# EAGLE design tbhb (EAGLE 6.4)
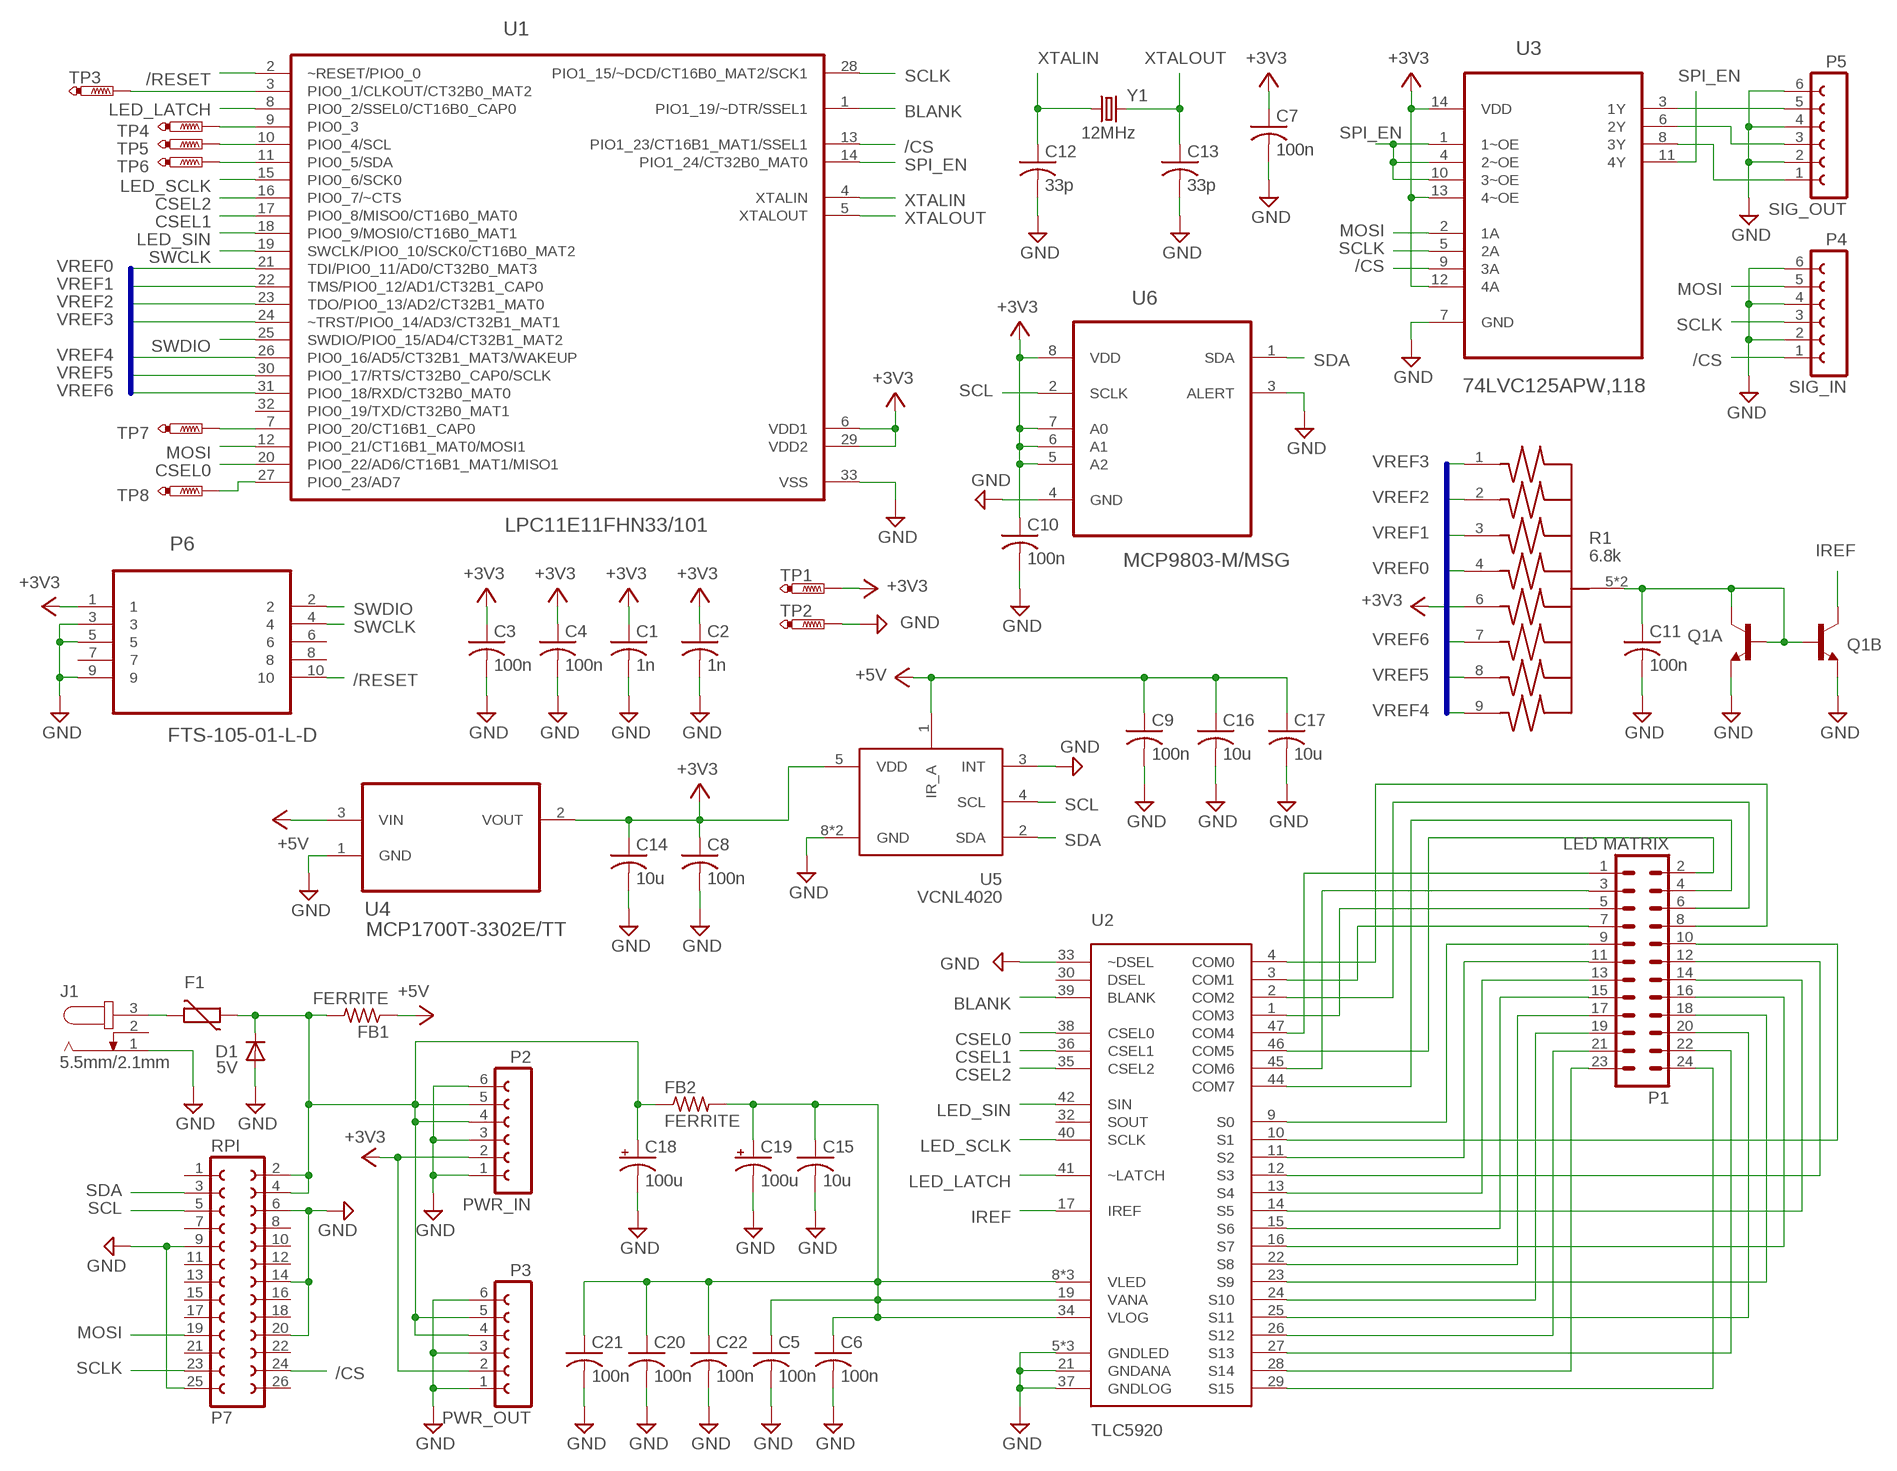
[diagram p0: schematic, sheet 1]

## Parts
C1  1n  C-USC0603  [C0603]
C2  1n  C-USC0603  [C0603]
C3  100n  C-USC0603  [C0603]
C4  100n  C-USC0603  [C0603]
C5  100n  C-USC0603  [C0603]
C6  100n  C-USC0603  [C0603]
C7  100n  C-USC0603  [C0603]
C8  100n  C-USC0603  [C0603]
C9  100n  C-USC0603  [C0603]
C10  100n  C-USC0603  [C0603]
C11  100n  C-USC0603  [C0603]
C12  33p  C-USC0603  [C0603]
C13  33p  C-USC0603  [C0603]
C14  10u  C-USC0805  [C0805]
C15  10u  C-USC0805  [C0805]
C16  10u  C-USC0805  [C0805]
C17  10u  C-USC0805  [C0805]
C18  100u  CPOL-USCT6032  [CT6032]
C19  100u  CPOL-USCT6032  [CT6032]
C20  100n  C-USC0603  [C0603]
C21  100n  C-USC0603  [C0603]
C22  100n  C-USC0603  [C0603]
D1  5V  DIODE-SOD123  [SOD123]
F1  2A  VARISTORCN1812  [CT/CN1812]
FB1  FERRITE  R-US_R0603  [R0603]
FB2  FERRITE  R-US_R0603  [R0603]
J1  5.5mm/2.1mm  JACK-PLUG  [SPC4077-1]
P1  LED MATRIX  MA12-2  [MA12-2]
P2  PWR_IN  FE06-1  [FE06]
P3  PWR_OUT  FE06-1  [FE06]
P4  SIG_IN  FE06-1  [FE06]
P5  SIG_OUT  FE06-1  [FE06]
P6  FTS-105-01-L-D  [SAMTEC_FTS-105-01-L-D]
P7  RPI  FE13-2  [FE13-2]
Q1  CMLT5088E  [SOT563]
R1  6.8k  EXBD10C  [EXBD10C]
TP1  PTR1TP15R  [TP15R]
TP2  PTR1TP15R  [TP15R]
TP3  PTR1TP15R  [TP15R]
TP4  PTR1TP15R  [TP15R]
TP5  PTR1TP15R  [TP15R]
TP6  PTR1TP15R  [TP15R]
TP7  PTR1TP15R  [TP15R]
TP8  PTR1TP15R  [TP15R]
U1  LPC11E11FHN33/101  [QFN65P700X700X100-33N]
U2  TLC5920  [SOP63P1035X279-48N]
U3  74LVC125APW,118  [SOP65P640X110-14N]
U4  MCP1700T-3302E/TT  [SOT95P237X112-3N]
U5  VCNL4020  [VCNL4020]
U6  MCP9803-M/MSG  [SOP65P490X110-8N]
Y1  12MHz  CRYSTAL-50X32  [CRYSTAL-50X32]

## Nets
+3V3: C1.1 C2.1 C3.1 C4.1 C7.1 C8.1 C10.1 C14.1 P2.2 P3.2 P6.1 R1.6 TP1.TP U1.6(VDD1) U1.29(VDD2) U3.12(4A) U3.13(4~OE) U3.14(VDD) U4.2(VOUT) U5.5(VDD) U6.5(A2) U6.6(A1) U6.7(A0) U6.8(VDD)
+5V: C9.1 C16.1 C17.1 FB1.1 U4.3(VIN) U5.1(IR_A)
/CS: P4.1 P7.24 U1.13(PIO1_23/CT16B1_MAT1/SSEL1) U3.9(3A)
/RESET: P6.10 U1.2(~RESET/PIO0_0)
BLANK: U1.1(PIO1_19/~DTR/SSEL1) U2.39(BLANK)
CSEL0: U1.20(PIO0_22/AD6/CT16B1_MAT1/MISO1) U2.38(CSEL0)
CSEL1: U1.17(PIO0_8/MISO0/CT16B0_MAT0) U2.36(CSEL1)
CSEL2: U1.16(PIO0_7/~CTS) U2.35(CSEL2)
GND: C1.2 C2.2 C3.2 C4.2 C5.2 C6.2 C7.2 C8.2 C9.2 C10.2 C11.2 C12.2 C13.2 C14.2 C15.2 C16.2 C17.2 C18.- C19.- C20.2 C21.2 C22.2 D1.A J1.1 P2.1 P2.3 P2.6 P3.1 P3.3 P3.6 P4.2 P4.4 P4.6 P5.2 P5.4 P5.6 P6.3 P6.5 P6.9 P7.6 P7.9 P7.14 P7.20 P7.25 Q1.1(A:E) Q1.4(B:E) TP2.TP U1.33(VSS) U2.5(GNDLED) U2.21(GNDANA) U2.33(~DSEL) U2.37(GNDLOG) U2.43(GNDLED) U2.48(GNDLED) U3.7(GND) U4.1(GND) U5.3(INT) U5.8(GND) U5.9(GND) U6.3(ALERT) U6.4(GND)
IREF: Q1.3(B:C) U2.17(IREF)
LED_LATCH: U1.8(PIO0_2/SSEL0/CT16B0_CAP0) U2.41(~LATCH)
LED_SCLK: U1.15(PIO0_6/SCK0) U2.40(SCLK)
LED_SIN: U1.18(PIO0_9/MOSI0/CT16B0_MAT1) U2.42(SIN)
MOSI: P4.5 P7.19 U1.12(PIO0_21/CT16B1_MAT0/MOSI1) U3.2(1A)
N$1: TP3.TP U1.3(PIO0_1/CLKOUT/CT32B0_MAT2)
N$2: C18.+ D1.C F1.1 FB1.2 FB2.1 P2.4 P2.5 P3.4 P3.5 P7.2 P7.4
N$3: P1.1 U2.47(COM4)
N$4: P1.3 U2.45(COM6)
N$5: P1.5 U2.1(COM3)
N$6: P1.7 U2.3(COM1)
N$7: P1.8 U2.4(COM0)
N$8: P1.6 U2.2(COM2)
N$9: P1.4 U2.44(COM7)
N$10: P1.2 U2.46(COM5)
N$14: P1.9 U2.9(S0)
N$15: P1.11 U2.11(S2)
N$17: TP5.TP U1.10(PIO0_4/SCL)
N$18: TP4.TP U1.9(PIO0_3)
N$19: P1.23 U2.28(S14)
N$25: P1.24 U2.29(S15)
N$26: P1.12 U2.12(S3)
N$28: P1.22 U2.27(S13)
N$29: P1.21 U2.26(S12)
N$30: P1.19 U2.24(S10)
N$31: P5.1 U3.8(3Y)
N$32: P5.3 U3.6(2Y)
N$33: P5.5 U3.3(1Y)
N$34: C11.1 Q1.2(A:B) Q1.5(B:B) Q1.6(A:C) R1.5(C) R1.10(C)
N$35: F1.2 J1.3
N$36: TP6.TP U1.11(PIO0_5/SDA)
N$37: TP8.TP U1.27(PIO0_23/AD7)
N$38: P1.20 U2.25(S11)
N$39: TP7.TP U1.7(PIO0_20/CT16B1_CAP0)
N$40: P1.17 U2.22(S8)
N$41: P1.13 U2.13(S4)
N$42: P1.10 U2.10(S1)
N$43: P1.18 U2.23(S9)
N$44: P1.15 U2.15(S6)
N$46: P1.16 U2.16(S7)
N$47: P1.14 U2.14(S5)
SCL: P7.5 U5.4(SCL) U6.2(SCLK)
SCLK: P4.3 P7.23 U1.28(PIO1_15/~DCD/CT16B0_MAT2/SCK1) U3.5(2A)
SDA: P7.3 U5.2(SDA) U6.1(SDA)
SPI_EN: U1.14(PIO1_24/CT32B0_MAT0) U3.1(1~OE) U3.4(2~OE) U3.10(3~OE) U3.11(4Y)
SWCLK: P6.4 U1.19(SWCLK/PIO0_10/SCK0/CT16B0_MAT2)
SWDIO: P6.2 U1.25(SWDIO/PIO0_15/AD4/CT32B1_MAT2)
VLED: C5.1 C6.1 C15.1 C19.+ C20.1 C21.1 C22.1 FB2.2 U2.8(VLED) U2.18(VLED) U2.19(VANA) U2.31(VLED) U2.34(VLOG)
VREF0: R1.4 U1.21(TDI/PIO0_11/AD0/CT32B0_MAT3)
VREF1: R1.3 U1.22(TMS/PIO0_12/AD1/CT32B1_CAP0)
VREF2: R1.2 U1.23(TDO/PIO0_13/AD2/CT32B1_MAT0)
VREF3: R1.1 U1.24(~TRST/PIO0_14/AD3/CT32B1_MAT1)
VREF4: R1.9 U1.26(PIO0_16/AD5/CT32B1_MAT3/WAKEUP)
VREF5: R1.8 U1.30(PIO0_17/RTS/CT32B0_CAP0/SCLK)
VREF6: R1.7 U1.31(PIO0_18/RXD/CT32B0_MAT0)
XTALIN: C12.1 U1.4(XTALIN) Y1.1
XTALOUT: C13.1 U1.5(XTALOUT) Y1.2
Unconnected: J1.2 P6.6 P6.7 P6.8 P7.1 P7.7 P7.8 P7.10 P7.11 P7.12 P7.13 P7.15 P7.16 P7.17 P7.18 P7.21 P7.22 P7.26 U1.32(PIO0_19/TXD/CT32B0_MAT1) U2.30(DSEL) U2.32(SOUT)

## Buses
VREF[0..7]

## Library data of the parts
C1-C17 C20-C22 = rcl:C-US: CAPACITOR, American symbol
C18 C19 = rcl:CPOL-US: POLARIZED CAPACITOR, American symbol; PARTNUMBER: TR3C107K010C0200
D1 = diode:DIODE-: DIODE
F1 = varistor:VARISTOR: VARISTOR
FB1 FB2 = rcl:R-US_: RESISTOR, American symbol
J1 = tbhb:JACK-PLUG: DC POWER JACK Power Jack, DC, Right Angle, Through Hole, Rated 5A at 16VDC, PC Terminals Distributor: Farnell (www.Farnell.de) Drawing: 84N1161.pdf / 84N1162.pdf Manufacturer: SPC Technology (www.spctechnology.com) Type: SPC4077 / SPC 4078
P1 = con-lstb:MA12-2: PIN HEADER; OC_FARNELL: unknown; OC_NEWARK: unknown
P2-P5 = tbhb:FE06-1: FEMALE HEADER; OC_FARNELL: unknown; OC_NEWARK: unknown
P6 = tbhb:FTS-105-01-L-D: CONN HEADER, 1.27MM, THRU HOLE, 10WAY; MPN: FTS-105-01-L-D; OC_FARNELL: 1667728; OC_NEWARK: 11P4652; PACKAGE: HEADER, 1.27MM, THRU HOLE, 10WAY; SUPPLIER: Samtec
P7 = tbhb:FE13-2: FEMALE HEADER; OC_FARNELL: unknown; OC_NEWARK: unknown
Q1 = tbhb:CMLT5088E: DUAL NPN/NPN L88 TRANSISTORS ENHANCED SPECIFICATION PICOmini(TM) SURFACE MOUNT Source: CMLT5078%20SERIES.pdf
R1 = digikey:EXBD10C
TP1-TP8 = testpad:PTR1: TEST PIN
U1 = digikey:LPC11E11FHN33/101: 32-bit ARM Cortex-M0 microcontroller up to 32 kB flash and 8 kB SRAM
U2 = digikey:TLC5920
U3 = NXP_By_element14_Batch_1:74LVC125APW,118: Quad buffer/line driver with 5 V tolerant input/outputs; MPN: 74LVC125APW,118; OC_FARNELL: 1826647; OC_NEWARK: 78R7407; PACKAGE: TSSOP-14; SUPPLIER: NXP
U4 = Microchip_By_element14_Batch_1:MCP1700T-3302E/TT: Low Quiescent Current LDO; MPN: MCP1700T-3302E/TT; OC_FARNELL: 1296592; OC_NEWARK: 88H9817; PACKAGE: SOT23-3; SUPPLIER: Microchip
U5 = digikey:VCNL4020
U6 = Microchip_By_element14_Batch_1:MCP9803-M/MSG: 2-Wire High-Accuracy Temperature Sensor; DESCRIPTION: THERMAL SENSOR; MPN: MCP9803-M/MSG; OC_FARNELL: 9413944; OC_NEWARK: 38K4809; PACKAGE: MSOP-8; SUPPLIER: MICROCHIP
Y1 = digikey:CRYSTAL-50X32: SMD CRYSTAL Source: www.ecsxtal.com .. Crystal 3.6864MHz CSM_7X_DU.PDF; OC_FARNELL: unknown; OC_NEWARK: unknown

## Board
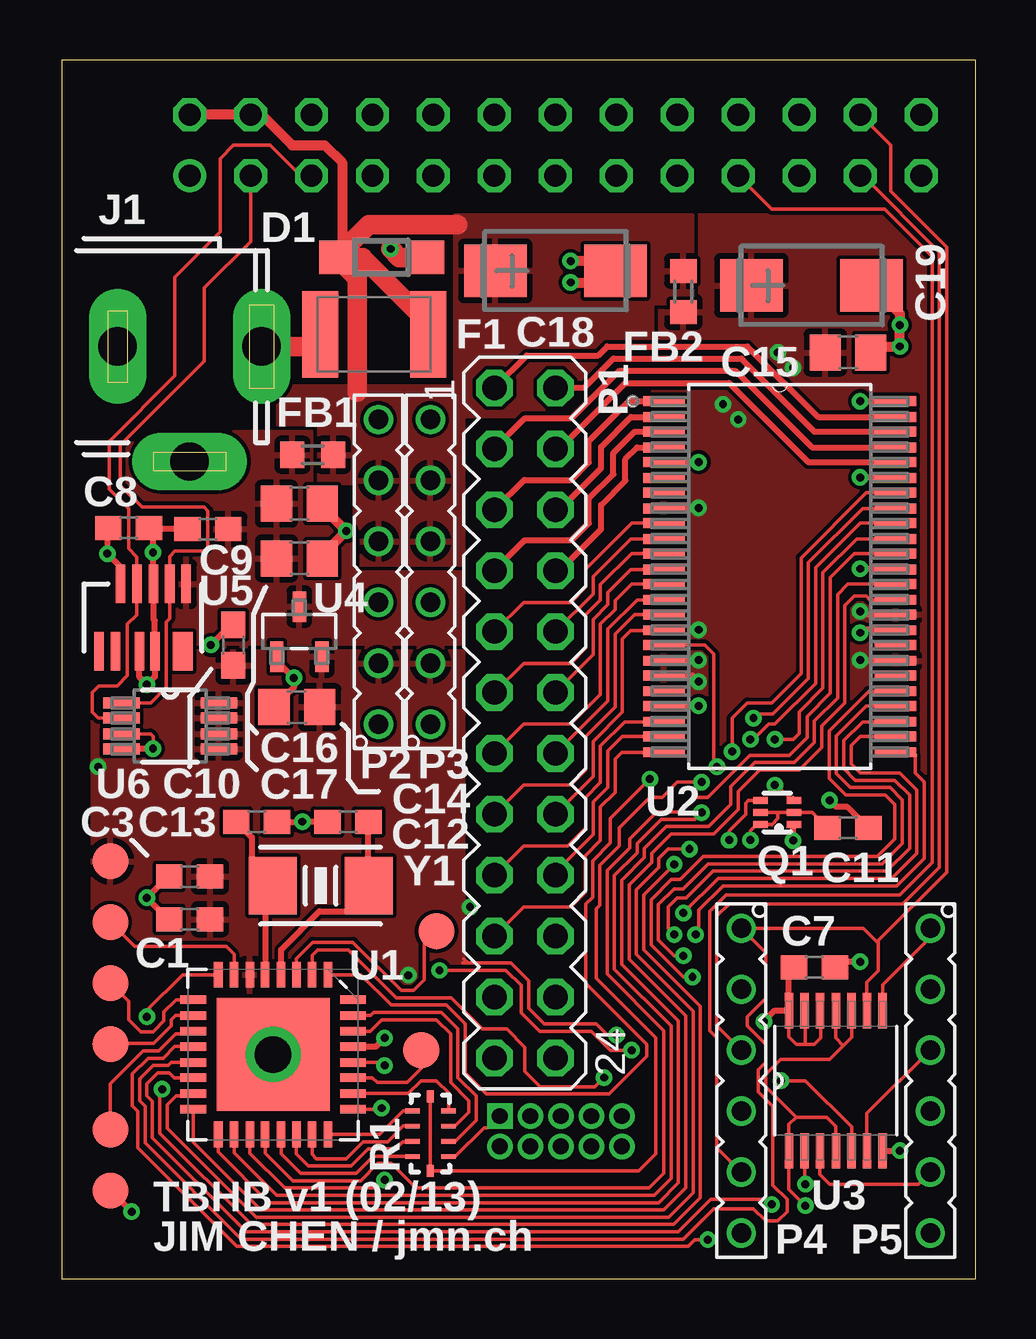
[diagram p1: board, top side]
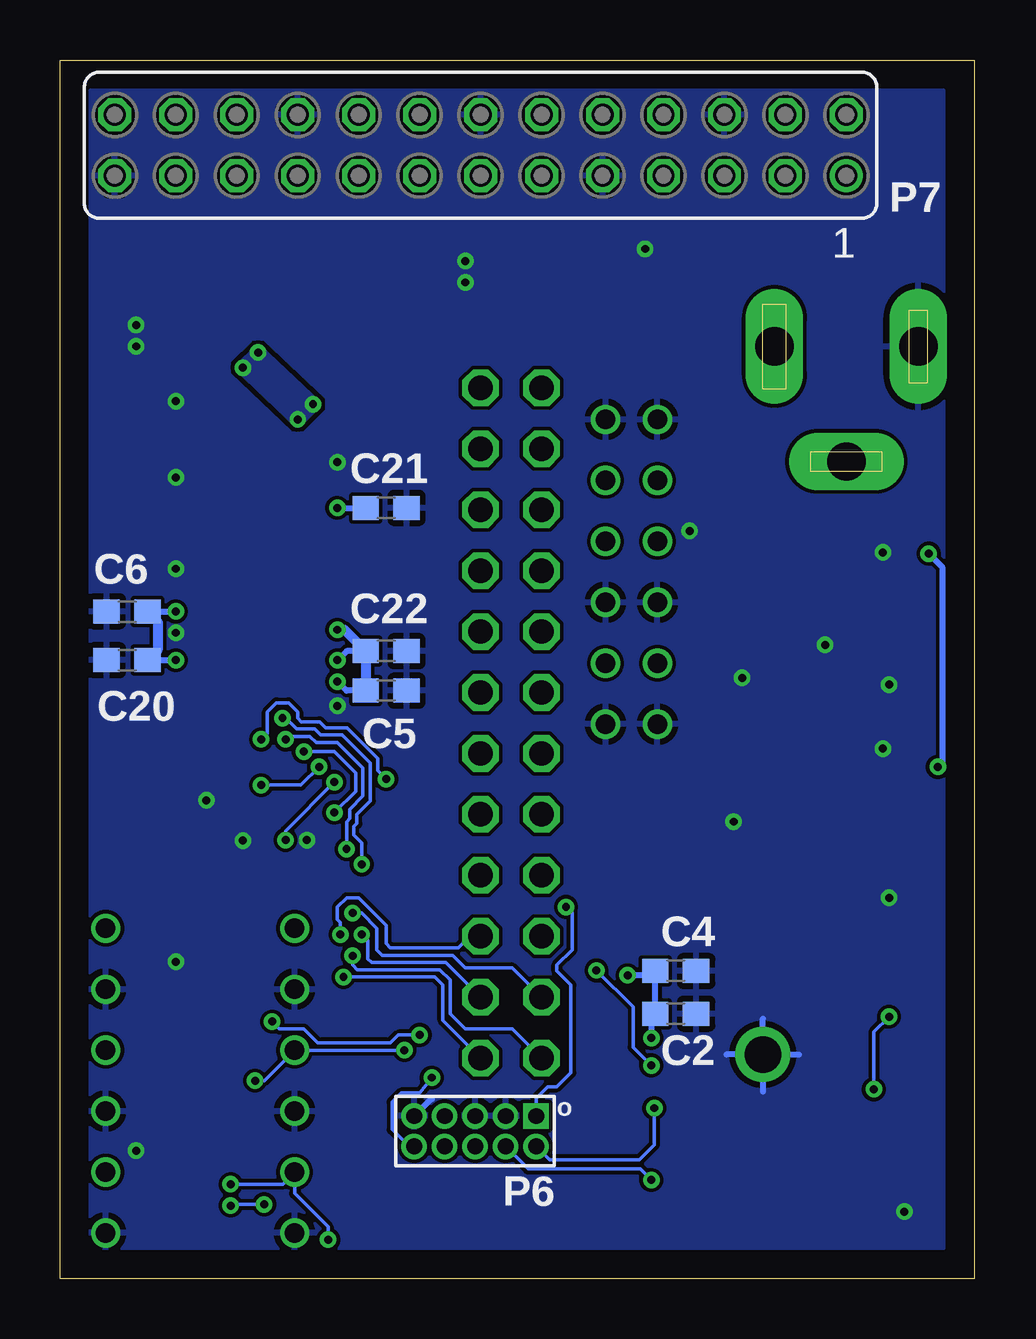
[diagram p2: board, bottom side, seen from below]

Size 38.1 x 50.8 mm. Coordinates in mm from the lower left corner, seen from the top.
Outline: 0,0 38.1,0 38.1,50.8 0,50.8 0,0
Copper layers (1*16): Top 0.0356mm / dielectric 1.5011mm / Bottom 0.0356mm
Design rules "LaenPCBOrder *": minimum track width 6mil, minimum drill 13mil, track to track 6mil, track to pad 6mil, pad to pad 6mil, via to via 6mil, smd to smd 6mil, copper to edge 15mil, drill to drill 6mil, minimum pad ring 7mil, minimum via ring 7mil, stop-mask expansion 2mil, vias tented up to drill 20mil, thermal gap 10mil
bRestrict: area 7.5,8.1 to 10.1,10.6

### Footprints (pad centres in the part's own frame; a part is rotated, then mirrored left to right if it is on the bottom)
C0603 = smd 1.1 x 1: 1 -0.85,0; 2 0.85,0
C0805 = smd 1.3 x 1.5: 1 -0.95,0; 2 0.95,0
CT6032 = smd 2.6 x 2.2: + -2.5,0; - 2.5,0
SOD123 = smd 1.4 x 1.4: A 1.9,0; C -1.9,0
CT/CN1812 = smd 1.5 x 3.6: 1 -2.25,0; 2 2.25,0
R0603 = smd 1 x 1.1: 1 -0.85,0; 2 0.85,0
SPC4077-1 = drill 1.6 pad 2.184 long: 1 -3,0; 2 0,-4.8; 3 3,0
MA12-2 = drill 1.016 octagon: 1 -13.97,-1.27; 2 -13.97,1.27; 3 -11.43,-1.27; 4 -11.43,1.27; 5 -8.89,-1.27; 6 -8.89,1.27; 7 -6.35,-1.27; 8 -6.35,1.27; 9 -3.81,-1.27; 10 -3.81,1.27; 11 -1.27,-1.27; 12 -1.27,1.27; 13 1.27,-1.27; 14 1.27,1.27; 15 3.81,-1.27; 16 3.81,1.27; 17 6.35,-1.27; 18 6.35,1.27; 19 8.89,-1.27; 20 8.89,1.27; 21 11.43,-1.27; 22 11.43,1.27; 23 13.97,-1.27; 24 13.97,1.27
FE06 = drill 0.813: 1 -6.35,0; 2 -3.81,0; 3 -1.27,0; 4 1.27,0; 5 3.81,0; 6 6.35,0
SAMTEC_FTS-105-01-L-D = drill 0.66 pad 1.067 square: 1 -5.08,-1.27 | drill 0.66 pad 1.067: 2 -5.08,0; 3 -3.81,-1.27; 4 -3.81,0; 5 -2.54,-1.27; 6 -2.54,0; 7 -1.27,-1.27; 8 -1.27,0; 9 0,-1.27; 10 0,0
FE13-2 = drill 0.914: 1 -15.24,1.27 | drill 0.914 octagon: 2 -15.24,-1.27; 3 -12.7,1.27; 4 -12.7,-1.27; 5 -10.16,1.27; 6 -10.16,-1.27; 7 -7.62,1.27; 8 -7.62,-1.27; 9 -5.08,1.27; 10 -5.08,-1.27; 11 -2.54,1.27; 12 -2.54,-1.27; 13 0,1.27; 14 0,-1.27; 15 2.54,1.27; 16 2.54,-1.27; 17 5.08,1.27; 18 5.08,-1.27; 19 7.62,1.27; 20 7.62,-1.27; 21 10.16,1.27; 22 10.16,-1.27; 23 12.7,1.27; 24 12.7,-1.27; 25 15.24,1.27; 26 15.24,-1.27
SOT563 = smd 0.3 x 0.6: 1 -0.5,-0.7; 2 0,-0.7; 3 0.5,-0.7; 4 0.5,0.7; 5 0,0.7; 6 -0.5,0.7
EXBD10C = smd 0.2 x 0.6: 1 -0.953,-0.75; 2 -0.318,-0.75; 3 0.318,-0.75; 4 0.953,-0.75; 6 0.953,0.75; 7 0.318,0.75; 8 -0.318,0.75; 9 -0.953,0.75 | smd 0.5 x 0.3: 5 1.55,0; 10 -1.55,0
TP15R = smd 1.5 x 1.5: TP 0,0
QFN65P700X700X100-33N = smd 1.067 x 0.356: 1 -3.327,2.286; 2 -3.327,1.626; 3 -3.327,0.965; 4 -3.327,0.33; 5 -3.327,-0.33; 6 -3.327,-0.965; 7 -3.327,-1.626; 8 -3.327,-2.286; 17 3.327,-2.286; 18 3.327,-1.626; 19 3.327,-0.965; 20 3.327,-0.33; 21 3.327,0.33; 22 3.327,0.965; 23 3.327,1.626; 24 3.327,2.286 | smd 0.356 x 1.067: 9 -2.286,-3.327; 10 -1.626,-3.327; 11 -0.965,-3.327; 12 -0.33,-3.327; 13 0.33,-3.327; 14 0.965,-3.327; 15 1.626,-3.327; 16 2.286,-3.327; 25 2.286,3.327; 26 1.626,3.327; 27 0.965,3.327; 28 0.33,3.327; 29 -0.33,3.327; 30 -0.965,3.327; 31 -1.626,3.327; 32 -2.286,3.327 | smd 4.699 x 4.699: 33 0,0
SOP63P1035X279-48N = smd 1.727 x 0.406: 1 -4.826,7.315; 2 -4.826,6.655; 3 -4.826,6.045; 4 -4.826,5.385; 5 -4.826,4.775; 6 -4.826,4.115; 7 -4.826,3.505; 8 -4.826,2.845; 9 -4.826,2.235; 10 -4.826,1.575; 11 -4.826,0.965; 12 -4.826,0.305; 13 -4.826,-0.305; 14 -4.826,-0.965; 15 -4.826,-1.575; 16 -4.826,-2.235; 17 -4.826,-2.845; 18 -4.826,-3.505; 19 -4.826,-4.115; 20 -4.826,-4.775; 21 -4.826,-5.385; 22 -4.826,-6.045; 23 -4.826,-6.655; 24 -4.826,-7.315; 25 4.826,-7.315; 26 4.826,-6.655; 27 4.826,-6.045; 28 4.826,-5.385; 29 4.826,-4.775; 30 4.826,-4.115; 31 4.826,-3.505; 32 4.826,-2.845; 33 4.826,-2.235; 34 4.826,-1.575; 35 4.826,-0.965; 36 4.826,-0.305; 37 4.826,0.305; 38 4.826,0.965; 39 4.826,1.575; 40 4.826,2.235; 41 4.826,2.845; 42 4.826,3.505; 43 4.826,4.115; 44 4.826,4.775; 45 4.826,5.385; 46 4.826,6.045; 47 4.826,6.655; 48 4.826,7.315
SOP65P640X110-14N = smd 1.473 x 0.356: 1 -2.921,1.956; 2 -2.921,1.295; 3 -2.921,0.66; 4 -2.921,0; 5 -2.921,-0.66; 6 -2.921,-1.295; 7 -2.921,-1.956; 8 2.921,-1.956; 9 2.921,-1.295; 10 2.921,-0.66; 11 2.921,0; 12 2.921,0.66; 13 2.921,1.295; 14 2.921,1.956
SOT95P237X112-3N = smd 0.559 x 1.27: 1 -0.94,-1.041; 2 0.94,-1.041; 3 0,1.041
VCNL4020 = smd 0.4 x 1.6: 1 0.65,-2.8; 2 1.335,-2.8; 3 2.02,-2.8; 4 2.705,-2.8; 5 3.39,-2.8; 6 4.28,0; 7 3.6,0; 8 2.6,0; 9 1.95,0 | smd 0.83 x 1.6: 10 0.785,0
SOP65P490X110-8N = smd 1.524 x 0.457: 1 -2.032,0.965; 2 -2.032,0.33; 3 -2.032,-0.33; 4 -2.032,-0.965; 5 2.032,-0.965; 6 2.032,-0.33; 7 2.032,0.33; 8 2.032,0.965
CRYSTAL-50X32 = smd 2 x 2.4: 1 -2,0; 2 2,0

### Placement (x,y rotation side)
C1  5.33,14.99 180 top
C2  12.45,11.05 0 bottom
C3  5.33,16.76 180 top
C4  12.45,12.83 0 bottom
C5  24.51,24.51 0 bottom
C6  35.31,27.81 180 bottom
C7  31.37,12.98 0 top
C8  2.79,31.29 0 top
C9  6.1,31.24 180 top
C10  7.16,26.42 90 top
C11  32.77,18.8 0 top
C12  11.94,19.05 180 top
C13  8.13,19.05 0 top
C14  9.8,23.83 180 top
C15  32.77,38.61 0 top
C16  9.91,32.31 0 top
C17  9.91,30.02 0 top
C18  20.57,42.01 0 top
C19  31.24,41.4 0 top
C20  35.31,25.78 180 bottom
C21  24.51,32.13 0 bottom
C22  24.51,26.16 0 bottom
D1  13.34,42.57 0 top
F1  13.03,39.37 180 top
FB1  10.46,34.34 0 top
FB2  25.91,41.15 270 top
J1  5.33,38.86 0 top
P1  19.3,23.16 270 top
P2  13.21,29.46 90 top
P3  15.37,29.46 90 top
P4  28.32,8.26 270 top
P5  36.2,8.26 270 top
P6  23.34,5.51 180 bottom
P7  20.57,47.24 180 bottom
Q1  29.82,19.43 90 top
R1  15.37,6.05 270 top
TP1  2.03,17.4 0 top
TP2  2.03,3.68 0 top
TP3  15.62,14.48 0 top
TP4  2.03,12.32 0 top
TP5  2.03,9.78 0 top
TP6  2.03,6.22 0 top
TP7  2.03,14.86 0 top
TP8  14.99,9.53 0 top
U1  8.81,9.35 270 top
U2  29.92,29.26 0 top
U3  32.26,8.26 90 top
U4  9.91,26.97 0 top
U5  5.84,26.16 180 top
U6  4.52,23.04 0 top
Y1  10.79,16.38 180 top

### Tracks (layer width: path | path; a pad name or v marks a point on that pad's centre or on a via)
+3V3  (via drill 0.33)
  Top 0.152: U3.13 30.99,11.18 30.99,9.78 | 31.62,11.18 U3.12 31.62,11.15 31.62,10.03 31.37,9.78 30.99,9.78 | P6.1 17.78,6.3 17.6,6.3 16.4,5.09 R1.6 | 16.94,13.16 18.72,13.16 19.46,12.42 19.46,11.28 20.12,10.62 22.28,10.62 22.73,10.16 v23.11,10.16 | 16.94,13.16 16.71,13.16 | 16.94,13.16 16.76,13.34 | U3.14 30.3,10.08 30.61,9.78 30.99,9.78
  Top 0.254: U1.29 13.11,9.68 v13.46,10.03 | v29.26,10.72 29.72,11.18 U3.14 30.3,12.76 C7.1 | C8.1 1.91,31.2 v1.91,30.23 2.45,29.68 U5.5
  Bottom 0.152: P6.1 18.26,7.52 17.78,8 17.4,8 16.82,8.59 16.82,12.24 17.4,12.83 17.4,13.08 16.76,13.72 16.76,15.24 v17.02,15.49 | v23.11,10.16 24,10.16 24.33,9.83 27.36,9.83 27.94,10.41 28.96,10.41 v29.26,10.72
  Bottom 0.254: v13.46,10.03 13.46,10.88 C2.1 C4.1 13.47,12.65 v14.45,12.65 | v1.52,21.34 1.32,21.54 1.32,29.64 v1.91,30.23
  pour Top: 16.76,26.16 1.27,26.16 1.27,11.56 16.76,11.56
+5V
  pour Top (rank 2): 16.76,26.16 16.76,29.46 12.19,29.46 12.19,33.15 10.41,33.15 10.41,35.31 1.27,35.31 1.27,26.16
/CS
  Top 0.152: P7.24 34.54,47.24 34.54,45.34 36.88,43 36.88,16.94 34.04,14.1 34.04,13.97 | U3.9 33.55,12.34 34.04,12.83 34.04,13.97 | 34.04,13.97 33.4,14.61 P4.1 29.34,13.59 29.34,11.68 28.57,10.92 28.57,10.54 29.34,9.78 29.34,9.02 29.03,8.71 29.03,7.8 29.64,7.19 29.64,3.89 30.23,3.3 30.23,2.79 29.84,2.41 29.34,2.41 28.83,2.92 27.18,2.92 25.91,1.65 7.49,1.65 3.48,5.66 3.48,7.19 3.25,7.42 3.25,8.33 3.81,8.89 4.45,8.89 4.57,9.02 U1.13
/RESET  (via drill 0.33)
  Top 0.152: U1.2 10.44,13.49 10.67,13.72 11.94,13.72 13.95,11.71 16.23,11.71 17.53,10.41 18.54,10.41 19.3,9.65 19.3,8.64 19.94,8 22.23,8 v22.61,8.38
  Bottom 0.152: v22.61,8.38 23.11,7.75 23.88,7.75 24.26,7.37 24.26,6.22 23.55,5.51 P6.10
BLANK  (via drill 0.33)
  Top 0.152: U1.1 12.47,12.68 13.74,11.4 16.03,11.4 16.82,10.62 16.82,8.59 17.7,7.7 22.81,7.7 24.38,9.27 24.38,9.78 21.84,12.32 21.84,15.62 22.12,15.9 22.12,17.42 22.86,18.16 22.86,19.18 v24.51,20.83 | U2.39 33.12,30.84 31.73,29.44 31.73,24.61 30.73,23.62 30.73,22.73 30.48,22.48 v29.72,22.48
  Bottom 0.152: v24.51,20.83 24.87,21.18 24.87,21.69 26.14,22.96 27.03,22.96 27.28,23.22 28.04,23.22 28.19,23.37 28.19,23.62 28.57,24 29.08,24 29.46,23.62 29.46,22.73 v29.72,22.48 29.72,22.61 29.84,22.61
CSEL0
  Top 0.152: U1.20 8.48,5.23 9.63,4.09 12.47,4.09 13.18,4.8 13.74,4.8 14.76,3.79 24.49,3.79 25.09,4.39 25.09,10.34 22.73,12.7 22.73,17.02 23.67,17.96 23.67,18.34 24.79,19.46 25.81,19.46 26.42,20.07 26.92,20.07 28.68,21.82 30.33,21.82 31.06,22.55 31.06,23.44 32.03,24.41 32.03,29.23 33.02,30.23 U2.38
CSEL1
  Top 0.152: U1.17 6.53,5.28 8.64,3.17 24.89,3.17 25.7,3.99 25.7,10.74 23.34,13.11 23.34,16.61 24.28,17.55 24.28,17.93 25.2,18.85 26.98,18.85 27.89,19.76 27.89,20.52 28.88,21.51 30.53,21.51 31.37,22.35 31.37,23.24 32.33,24.21 32.33,28.52 32.77,28.96 U2.36
CSEL2
  Top 0.152: U1.16 5.49,5.69 8.31,2.87 25.09,2.87 26.01,3.79 26.01,10.95 23.65,13.31 23.65,16.41 24.59,17.35 24.59,17.73 25.4,18.54 27.18,18.54 28.19,19.56 28.19,20.32 29.08,21.21 30.73,21.21 31.67,22.15 31.67,23.04 32.64,24 32.64,28.07 33.02,28.45 33.53,28.45 33.68,28.3 U2.35
GND  (via drill 0.33, 1.52)
  Top 0.152: U6.3 3.71,22.71 3.81,22.61 v3.81,22.1 | Q1.4 28.62,19.93 28.5,19.81 28.5,19.36 27.81,18.67 v27.81,18.29
  Top 0.254: 3.82,31.06 3.81,31.08 | U3.7 v34.92,5.33 | U5.8 3.24,25.08 v3.56,24.77 3.89,25.1 U5.9 3.89,27.43 3.82,27.5 U5.3 3.82,30.24 v3.81,30.28 3.81,31.08 | 3.81,31.08 C8.2 3.67,31.24 C9.2 | TP2.TP v2.92,2.79 | C13.2 v10.03,19.05 C12.2 | U2.21 v26.54,23.88 | v26.54,34.04 U2.5 | U2.43 34.75,33.4 v33.27,33.4 | v33.27,36.58 U2.48 | U2.37 34.75,29.59 v33.27,29.59 | U2.33 34.75,27.05 33.4,27.05 v33.27,26.92 | v32,19.94 32.26,19.68 32.73,19.68 C11.2 | C3.2 4.45,16.76 v3.56,15.88 4.45,14.99 C1.2 | v33.27,13.21 32.45,13.21 C7.2 | v6.22,26.42 7.07,27.27 C10.2 | U6.4 2.77,22.1 v3.81,22.1 | U4.1 8.97,25.63 9.09,25.63 v9.68,25.04 9.68,24.65 C14.2 | v30.48,18.26 30.48,18.89 Q1.1
  Top 0.406: 10.85,32.3 C16.2 10.86,32.17 v11.86,31.17 10.85,30.15 10.85,30.03 C17.2 | D1.A 15.08,42.55 | 8.85,24.09 C14.2 | C19.- 34.92,40.22 v34.92,39.75 v34.92,38.86 33.97,38.86 C15.2 | v21.21,41.53 22.59,41.53 | C18.- 22.67,42.42 v21.21,42.42
  Top 0.813: 15.21,42.55 D1.A 14.07,42.57 v13.72,42.93
  Bottom 0.254: P6.9 22.63,7.49 22.61,7.49 | U1.33 10.34,9.35 | U1.33 8.81,10.85 | U1.33 7.32,9.35 | U1.33 8.81,7.8
  other vias: 8.81,9.35
  pour Bottom (rank 6): 1.27,1.27 1.27,49.53 36.83,49.53 36.83,1.27
IREF  (via drill 0.33)
  Top 0.152: 30.49,20.06 Q1.3 30.36,20.06 v29.72,20.57 | U2.17 26.8,26.42 27.18,26.04 27.18,21.46 v27.3,21.34
  Bottom 0.152: v29.72,20.57 28.07,20.57 v27.3,21.34
LED_LATCH  (via drill 0.33)
  Top 0.152: U1.8 5.05,12.68 3.56,11.18 v3.56,10.92 | v4.19,7.9 4.09,7.8 4.09,6.07 7.9,2.26 25.5,2.26 26.62,3.38 26.62,11.35 24.26,13.72 24.26,16 v25.53,17.27 | U2.41 33.38,32.11 31.11,29.84 31.11,25.02 29.64,23.55 29.01,23.55 v28.83,23.37
  Bottom 0.152: v3.56,10.92 4.19,10.29 v4.19,7.9 | v25.53,17.27 25.53,18.16 25.86,18.49 25.86,18.85 25.73,18.97 25.73,19.36 25.17,19.91 25.17,21.49 26.34,22.66 27.23,22.66 27.48,22.91 28.25,22.91 28.7,23.37 v28.83,23.37
LED_SCLK  (via drill 0.33)
  Top 0.152: U1.15 5.38,7.62 4.78,7.62 4.39,7.24 4.39,6.27 8.1,2.56 25.3,2.56 26.31,3.58 26.31,11.15 23.95,13.51 23.95,16.2 24.89,17.14 24.89,17.53 25.27,17.91 v26.16,17.91 | U2.40 33.27,31.5 31.42,29.64 31.42,24.82 29.72,23.11 29.46,23.11 28.83,22.48 v28.7,22.48
  Bottom 0.152: v26.16,17.91 26.16,19.05 26.04,19.18 26.04,19.56 25.48,20.12 25.48,21.29 26.54,22.35 27.43,22.35 27.69,22.61 28.57,22.61 v28.7,22.48
LED_SIN  (via drill 0.33)
  Top 0.152: U1.18 7.19,5.26 8.97,3.48 24.69,3.48 25.4,4.19 25.4,10.54 23.04,12.9 23.04,16.82 23.98,17.75 23.98,18.14 24.99,19.15 26.39,19.15 v26.67,19.43 | U2.42 33.53,32.77 30.81,30.05 30.81,25.22 29.59,24 28.57,24 27.94,23.37 v27.94,21.97
  Bottom 0.152: v26.67,19.43 25.78,20.32 25.78,21.08 26.67,21.97 v27.94,21.97
MOSI  (via drill 0.33)
  Top 0.152: P7.19 29.59,44.58 34.29,44.58 36.27,42.6 36.27,17.35 34.92,16 27.69,16 27,15.32 27,10.34 27.3,10.03 27.3,5.46 P4.5 | U1.12 4.72,9.68 4.24,9.2 3.61,9.2 2.95,8.53 2.95,7.21 3.17,6.99 3.17,5.46 7.29,1.35 26.11,1.35 26.39,1.63 v26.92,1.63 | U3.2 30.96,3.96 v30.99,3.94
  Bottom 0.152: v26.92,1.63 26.92,2.16 28.32,3.56 P4.5 28.83,3.94 v30.99,3.94
N$1
  Top 0.152: U1.3 9.78,13.34 10.46,14.02 12.14,14.02 14.15,12.01 14.68,12.01 15.11,12.45 15.11,13.97 TP3.TP
N$2
  Top 0.406: P7.2 P7.4 8.33,48.51 9.6,47.24 10.97,47.24 11.68,46.53 11.68,42.82 D1.C
  Top 0.813: F1.1 15.28,39.84 12.55,42.57 D1.C | D1.C 12.32,41.69 12.32,36.96 | D1.C 12.81,43.94 16.51,43.94
  pour Top (rank 3): 16.76,29.46 12.19,29.46 12.19,33.15 9.02,33.15 9.02,37.21 16.38,37.21 16.38,44.32 26.29,44.32 26.29,40.64 24.64,40.64 24.64,35.94 16.76,35.94
N$3
  Top 0.254: P1.1 19.38,38.48 22.35,38.48 22.73,38.86 28.57,38.86 31.52,35.92 U2.47
N$4
  Top 0.254: P1.3 19.3,35.87 21.26,35.87 23.24,37.85 28.07,37.85 31.27,34.65 U2.45
N$5
  Top 0.254: P1.5 19.28,33.3 21.23,33.3 21.97,34.04 21.97,34.92 23.62,36.58 U2.1
N$6
  Top 0.254: P1.7 19.3,30.79 21.26,30.79 21.97,31.5 21.97,32.51 22.99,33.53 22.99,34.42 23.88,35.31 U2.3
N$7
  Top 0.254: P1.8 20.75,29.52 22.48,31.24 22.48,32.26 23.5,33.27 23.5,34.16 23.98,34.65 U2.4
N$8
  Top 0.254: P1.6 20.75,32.05 22.48,33.78 22.48,34.67 23.72,35.92 U2.2
N$9
  Top 0.254: P1.4 20.75,34.59 23.5,37.34 27.81,37.34 31.11,34.04 U2.44
N$10
  Top 0.254: P1.2 21.77,37.13 22.99,38.35 28.32,38.35 31.37,35.31 U2.46
N$14
  Top 0.152: P1.9 19.25,28.19 21.21,28.19 21.84,28.83 21.84,29.59 23.75,31.5 U2.9
N$15
  Top 0.152: P1.11 19.25,25.65 21.21,25.65 21.84,26.29 21.84,27.69 22.45,28.3 22.45,28.93 23.75,30.23 U2.11
N$17
  Top 0.152: TP5.TP 2.06,9.8 3.83,9.8 4.57,10.54 4.57,10.79 4.75,10.97 U1.10
N$18
  Top 0.152: U1.9 4.78,11.63 4.27,11.12 4.27,10.74 3.81,10.29 3.3,10.29 2.79,10.79 2.79,11.56 TP4.TP
N$19  (via drill 0.33)
  Top 0.152: v25.91,13.46 25.53,13.46 24.87,14.12 24.87,15.6 25.53,16.26 25.91,16.26 26.95,17.3 34.19,17.3 35.03,18.14 35.03,19.96 34.52,20.47 32.87,20.47 32.28,21.06 32.28,22.63 33.53,23.88 U2.28
  Bottom 0.152: P1.23 19.25,10.41 21.21,10.41 21.84,11.05 21.84,12.45 22.28,12.88 25.7,12.88 25.91,13.08 v25.91,13.46
N$25  (via drill 0.33)
  Top 0.152: v26.29,12.57 25.91,12.57 24.56,13.92 24.56,15.8 25.4,16.64 25.78,16.64 26.75,17.6 33.98,17.6 34.72,18.34 34.72,19.76 34.31,20.17 32.66,20.17 31.98,20.85 31.98,22.84 33.63,24.49 U2.29
  Bottom 0.152: P1.24 22.15,10.77 22.15,12.24 22.48,12.57 v26.29,12.57
N$26
  Top 0.152: P1.12 22.15,26.01 22.15,27.48 22.76,28.09 22.76,28.6 23.72,29.57 U2.12
N$28  (via drill 0.33)
  Top 0.152: v25.53,14.35 25.27,14.61 25.27,15.49 25.65,15.88 26.04,15.88 27.15,16.99 34.39,16.99 35.33,17.93 35.33,20.17 34.72,20.78 33.07,20.78 32.59,21.26 32.59,22.43 33.38,23.22 U2.27
  Bottom 0.152: P1.22 22.02,13.18 25.12,13.18 25.27,13.34 25.27,14.1 v25.53,14.35
N$29  (via drill 0.33)
  Top 0.152: U2.26 33.27,22.61 32.89,22.23 32.89,21.46 33.27,21.08 34.92,21.08 35.64,20.37 35.64,17.73 34.59,16.69 27.36,16.69 v25.91,15.24
  Bottom 0.152: P1.21 19.25,12.95 21.21,12.95 21.74,13.49 24.66,13.49 24.89,13.72 24.89,14.61 25.53,15.24 v25.91,15.24
N$30
  Top 0.152: P1.19 19.25,15.49 21.21,15.49 21.82,16.1 21.82,17.63 22.45,18.26 22.45,19.66 23.06,20.27 23.06,21.67 23.34,21.95 U2.24
N$31
  Top 0.152: U3.8 34.21,12.24 36.2,14.22 P5.1
N$32
  Top 0.152: U3.6 33.55,6.88 P5.3
N$33
  Top 0.152: U3.3 31.6,4.34 32,3.94 35.69,3.94 P5.5
N$34  (via drill 0.33)
  Top 0.152: R1.10 R1.5 24.05,4.5 24.77,5.21 24.77,10.03 22.28,12.52 22.28,15.42 22.43,15.57 22.43,17.22 23.24,18.03 23.24,18.8 24.51,20.07 25.02,20.07 25.65,20.7 v26.67,20.7 | C11.1 31.28,19.43 Q1.2 29.84,19.43 | Q1.5 29.84,19.43 | 29.84,19.43 29.84,19.18 29.59,18.92 29.58,18.93 Q1.6 28.96,18.93 28.7,18.67 v28.7,18.29
  Bottom 0.152: v26.67,20.7 28.7,18.67 v28.7,18.29
N$35
  Top 0.813: F1.2 10.27,38.86 J1.3
N$36
  Top 0.152: U1.11 5.38,10.21 4.75,10.21 4.04,9.5 3.4,9.5 2.03,8.13 TP6.TP
N$37
  Top 0.152: U1.27 12.95,8.38 13.16,8.18 14.4,8.18 14.99,8.76 TP8.TP
N$38  (via drill 0.33)
  Top 0.152: U2.25 35.46,21.95 35.56,21.84 35.56,21.08 35.94,20.7 35.94,17.53 34.8,16.38 27.56,16.38 26.54,15.37 26.54,14.48 v26.42,14.35
  Bottom 0.152: P1.20 21.03,14.28 21.51,13.79 24.33,13.79 24.51,13.97 24.51,14.73 25.65,15.88 26.16,15.88 26.54,15.49 26.54,14.99 26.42,14.86 v26.42,14.35
N$39
  Top 0.152: U1.7 7.19,13.51 6.86,13.84 3.05,13.84 TP7.TP
N$40
  Top 0.152: P1.17 19.25,18.03 21.08,18.03 21.84,18.8 21.84,20.07 22.45,20.68 22.45,22.2 23.47,23.22 U2.22
N$41
  Top 0.152: P1.13 19.25,23.11 21.21,23.11 22.45,24.36 22.45,27.28 23.06,27.89 23.06,28.27 23.75,28.96 U2.13
N$42
  Top 0.152: P1.10 22.15,28.55 22.15,29.26 23.72,30.84 U2.10
N$43
  Top 0.152: U2.23 23.37,22.61 22.76,22 22.76,20.47 22.15,19.86 22.15,18.52 20.57,16.94 P1.18
N$44
  Top 0.152: P1.15 19.25,20.57 21.21,20.57 21.84,21.21 21.84,22.61 23.06,23.82 23.06,26.87 23.88,27.69 U2.15
N$46
  Top 0.152: P1.16 22.15,20.93 22.15,22.4 23.37,23.62 23.37,26.67 23.72,27.03 U2.16
N$47
  Top 0.152: P1.14 22.76,24.08 22.76,27.08 23.98,28.3 U2.14
SCL
  Top 0.152: P7.5 9.96,45.97 8.69,47.24 7.16,47.24 6.6,46.69 6.6,43.64 4.72,41.76 4.72,37.64 1.98,34.9 1.98,32.92 2.79,32.11 2.79,30.43 3.14,30.09 U5.4 3.14,27.67 2.74,27.28 2.74,25.15 2.31,24.71 1.55,24.71 1.27,24.43 1.27,23.62 1.52,23.37 U6.2
SCLK  (via drill 0.33)
  Top 0.152: v29.97,8.26 30.99,8.26 32.92,6.33 U3.5 | v13.46,8.89 13.34,9.02 U1.28 | P4.3 27.3,10.54 27.3,15.11 27.81,15.62 35.05,15.62 36.58,17.14 36.58,42.8 33.4,45.97 P7.23 | v15.75,12.85 18.52,12.85 19.15,12.22 19.15,11.07 19.91,10.31 22.07,10.31 22.86,9.53 v23.75,9.53
  Bottom 0.152: v29.97,8.26 29.59,8.26 P4.3 v23.75,9.53 | v13.46,8.89 14.22,9.65 14.22,11.33 v15.75,12.85
SDA
  Top 0.152: P7.3 7.87,43.23 5.94,41.3 5.94,38.25 2.44,34.75 2.44,33.07 3.35,32.16 5.94,32.16 6.1,32 6.1,30.48 5.94,30.33 4.72,30.33 4.51,30.11 U5.2 4.51,27.52 4.37,27.38 4.37,24.66 3.71,24 U6.1
SPI_EN  (via drill 0.33)
  Top 0.152: U3.10 32.92,10.06 32.58,9.72 | 32.58,9.72 32,9.14 29.97,9.14 29.34,8.51 29.34,8 30.61,6.73 | U3.4 32.26,6.35 31.88,6.73 30.61,6.73 | 30.61,6.73 30.3,6.43 U3.1 30.3,3.73 v30.99,3.05 | U1.14 4.7,8.38 4.5,8.59 4.01,8.59 3.56,8.13 3.56,7.62 3.79,7.39 3.79,5.87 7.7,1.96 25.7,1.96 27.05,3.3 29.39,3.3 v29.59,3.1 | U3.11 32.26,10.03 32.58,9.72
  Bottom 0.152: v30.99,3.05 30.94,3.1 v29.59,3.1
SWCLK  (via drill 0.33)
  Top 0.152: U1.19 7.85,5.23 9.3,3.79 13.13,3.79 v13.46,4.12
  Bottom 0.152: P6.4 18.59,4.57 13.92,4.57 v13.46,4.12
SWDIO  (via drill 0.33)
  Top 0.152: v13.34,7.11 13.28,7.06 U1.25
  Bottom 0.152: v13.34,7.11 13.34,5.59 13.97,4.95 17.7,4.95 P6.2
VLED  (via drill 0.33)
  Top 0.254: U2.31 33.3,25.76 v33.27,25.78 | U2.34 33.4,27.69 v33.27,27.81 | U2.8 26.52,32.11 v26.54,32.13 | U2.18 26.52,25.76 v26.54,25.78 | U2.19 26.29,25.15 v26.54,24.89
  Bottom 0.254: C6.1 v33.27,27.81 | C20.1 v33.27,25.78 | v26.54,32.13 C21.1 | C5.1 26.16,24.51 v26.54,24.89 | C22.1 26.16,26.16 v26.54,25.78
  Bottom 0.406: C6.1 34.04,27.39 34.04,26.2 C20.1 | v26.54,27.05 26.25,27.05 C22.1 C5.1
  other vias: 27.56,36.45 28.19,35.81 29.84,38.61 30.48,37.97
  pour Top: 26.04,37.34 33.78,37.34 33.78,21.21 26.04,21.21
  pour Bottom: 28.19,35.56 30.73,37.97 29.84,38.86 27.3,36.45
  pour Top (rank 4): 26.29,44.32 36.83,44.32 36.83,20.45 24.64,20.45 24.64,40.64 26.29,40.64
VREF0
  Top 0.152: U1.21 9.14,5.21 9.96,4.39 12.27,4.39 12.98,5.11 14.6,5.11 R1.4
VREF1
  Top 0.152: U1.22 9.78,5.21 10.29,4.7 12.06,4.7 12.78,5.41 13.92,5.41 14.22,5.71 14.6,5.71 R1.3
VREF2
  Top 0.152: U1.23 10.44,5.18 10.62,5 11.86,5 12.57,5.71 13.59,5.71 14.24,6.36 R1.2
VREF3
  Top 0.152: U1.24 13.26,6.02 14.24,7 R1.1
VREF4
  Top 0.152: U1.26 14.45,7.72 14.99,8.26 15.62,8.26 16.13,7.75 R1.9
VREF5
  Top 0.152: U1.30 12.85,10.31 13.34,10.79 15.62,10.79 16.2,10.21 16.2,8.18 16.97,7.42 16.97,6.93 16.4,6.36 R1.8
VREF6
  Top 0.152: U1.31 12.88,10.97 13.01,11.1 15.82,11.1 16.51,10.41 16.51,8.38 17.27,7.62 17.27,6.6 16.4,5.73 R1.7
XTALIN
  Top 0.254: U1.4 9.14,13.72 10.74,15.32 11.94,15.32 12.79,16.17 Y1.1 C12.1
XTALOUT
  Top 0.254: U1.5 8.48,16.07 Y1.2 7.92,17.25 7.92,18.4 C13.1

### Text on the board
tPlace: TBHB v1 (02/13) | JIM CHEN / jmn.ch